# Altium schematic sheet Power.SchDoc
size A4; SheetNumber: 3; SheetTotal: 8
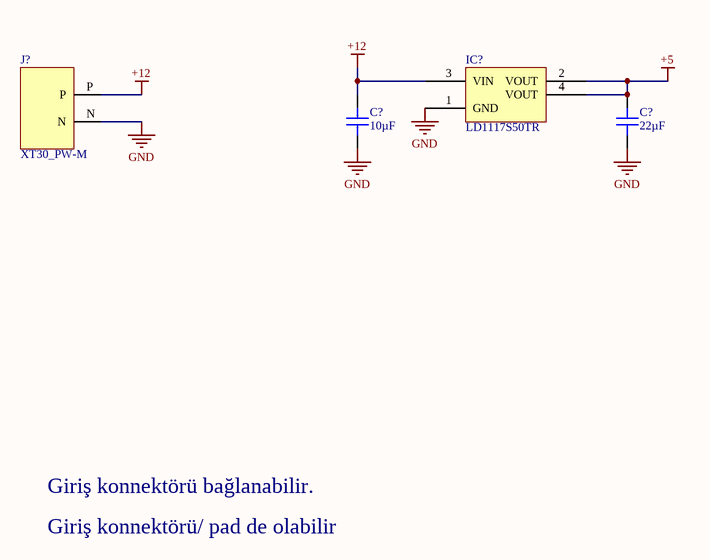
[diagram p0: Power.SchDoc]

## Parts
(Parts that share a designator on the sheet are numbered #1, #2 ... from top to bottom, then left to right.)
C?#1  10µF  [CAP 0805_2012]
C?#2  22µF  [CAP 0805_2012]
IC?  LD1117S50TR  [ST SOT-223]
J?  XT30_PW-M  [XT30_PW-M]

## Nets
+5: C?#2.2 IC?.2(VOUT) IC?.4(VOUT)
+12: C?#1.2 IC?.3(VIN) J?.P
GND: C?#1.1 C?#2.1 IC?.1(GND) J?.N

## Notes on the sheet
- Giriş konnektörü bağlanabilir.
- Giriş konnektörü/ pad de olabilir

## Library data of the parts
C?#1 = 08053D106KAT2A: CAP CER 10UF 25V X5R 0805; manufacturer: AVX Corporation; Tolerance: ±10%; Part Number: 08053D106KAT2A; Capacitance: 10µF; Applications: General Purpose; componentlink1description: Datasheet; componentlink1url: http://datasheets.avx.com/cx5r.pdf; componentlink2description: DigiKey Link; componentlink2url: http://digikey.com/product-detail/en/avx-corporation/08053D106KAT2A/478-7436-1-ND/3660337; Device Package: 0805 (2012 Metric); lastupdated: 2.09.2020 01:04:14; Lifecycle Status: Active; Minimum Order: 1; Mounting Type: Surface Mount, MLCC; Operating Temperature: -55°C ~ 85°C; Package / Case: 0805 (2012 Metric); packaging: TapeAndReel; partid: 15850; Part Status: Active; price: 0.13; series: -; Size / Dimension: 0.079" L x 0.049" W (2.00mm x 1.25mm); Supplier 1: DigiKey; Supplier Part Number 1: 478-7436-1-ND; Temperature Coefficient: X5R; Thickness (Max): 0.051" (1.30mm); value: 10µF; Voltage - Rated: 25V; LCSC Part Number: C15850
C?#2 = 0805ZD226MAT2A: CAP CER 22UF 10V X5R 0805; manufacturer: AVX Corporation; Tolerance: ±20%; Part Number: 0805ZD226MAT2A; Capacitance: 22µF; Applications: General Purpose; componentlink1description: Datasheet; componentlink1url: http://datasheets.avx.com/cx5r.pdf; componentlink2description: DigiKey Link; componentlink2url: http://digikey.com/product-detail/en/avx-corporation/0805ZD226MAT2A/478-7966-1-ND/3881589; Device Package: 0805 (2012 Metric); lastupdated: 2.09.2020 01:04:32; Lifecycle Status: Active; Minimum Order: 1; Mounting Type: Surface Mount, MLCC; Operating Temperature: -55°C ~ 85°C; Package / Case: 0805 (2012 Metric); packaging: TapeAndReel; partid: 7750; Part Status: Active; price: 0.10; series: -; Size / Dimension: 0.079" L x 0.049" W (2.00mm x 1.25mm); Supplier 1: DigiKey; Supplier Part Number 1: 478-7966-1-ND; Temperature Coefficient: X5R; Thickness (Max): 0.060" (1.52mm); value: 22µF; Voltage - Rated: 10V; LCSC Parrt Number: C45783
IC? = LD1117S50TR: IC REG LINEAR 5V 800MA SOT223; Manufacturer: STMicroelectronics; Current - Quiescent (Iq): 10 mA; Number of Regulators: 1; Output Configuration: Positive; Output Type: Fixed; Protection Features: Over Current, Over Temperature; PSRR: 75dB (120Hz); Voltage Dropout (Max): 1.2V @ 800mA; Voltage - Input (Max): 15V; Part Number: LD1117S50TR; ComponentLink1Description: Datasheet; ComponentLink1URL: http://www.st.com/content/ccc/resource/technical/document/datasheet/99/3b/7d/91/91/51/4b/be/CD00000544.pdf/files/CD00000544.pdf/jcr:content/translations/en.CD00000544.pdf; ComponentLink2Description: DigiKey Link; ComponentLink2URL: https://www.digikey.com/en/products/detail/stmicroelectronics/LD1117S50TR/1038360; Current - Output: 800mA; LastUpdated: 3.06.2024 20:14:20; Lifecycle Status: Active; Minimum Order: 1; Mounting Type: Surface Mount; Operating Temperature: 0°C ~ 125°C; Package / Case: TO-261-4, TO-261AA; Packaging: TapeAndReel; Part Status: Active; Price: 0.13; Series: -; Supplier 1: DigiKey; Supplier Part Number 1: 497-6447-1-ND; Supplier Device Package: SOT-223; Voltage - Output (Min/Fixed): 5V; LCSC Part Number: C347223
J? = XT30_PW-M: JLCPCB Part Number: C431092